# Altium schematic sheet OPA_T12.SchDoc
size 165 x 104 mm; SheetNumber: 1; SheetTotal: 1
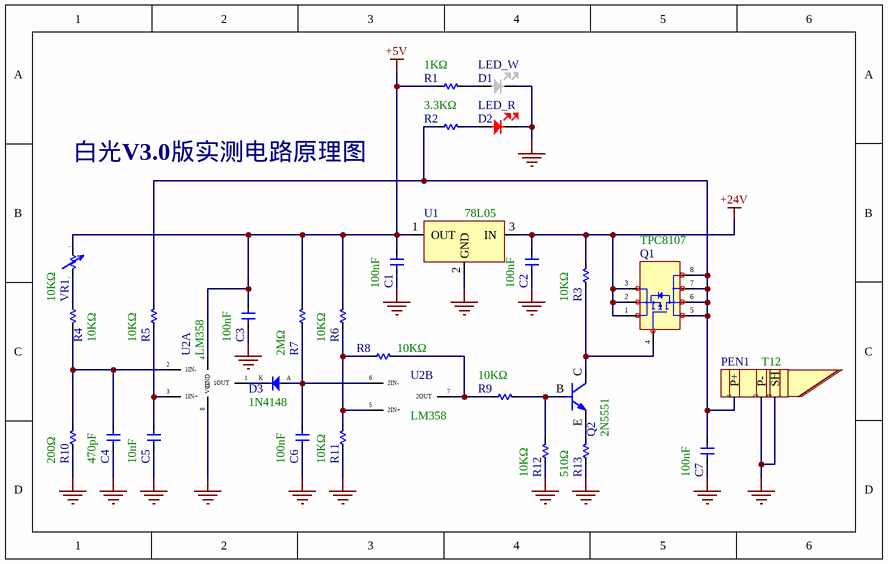
[diagram p0: OPA_T12.SchDoc]

## Parts
C1  100nF
C2  100nF
C3  100nF
C4  470pF
C5  10nF
C6  100nF
C7  100nF
D1  LED_W
D2  LED_R
D3  1N4148
PEN1  T12  [T13]
Q1  TPC8107  [SO-8M]
Q2  2N5551
R1  1KΩ
R2  3.3KΩ
R3  10KΩ
R4  10KΩ
R5  10KΩ
R6  10KΩ
R7  2MΩ
R8  10KΩ
R9  10KΩ
R10  200Ω
R11  10KΩ
R12  10KΩ
R13  510Ω
U1  78L05  [SOT-89]
U2  LM358  [SO-8]  (parts A,B of 2)
VR1  10KΩ

## Nets
+5V: C1.1 C3.1 R1.1 R6.2 R7.2 U1.1(OUT) U2.4(GND) VR1.1
+24V: C2.1 Q1.1(S) Q1.2(S) Q1.3(S) R3.2 U1.3(IN)
GND: C1.2 C2.2 C3.2 C4.2 C5.2 C6.2 C7.2 D1.C(CATHODE) D2.C(CATHODE) PEN1.2(P-) PEN1.3(SH) R10.1 R11.1 R12.1 R13.1 U1.2(GND) U2.8(VCC)
NetC4_1: C4.1 R4.2 R10.2 U2.2(1IN-)
NetC5_1: C5.1 R5.1 U2.3(1IN+)
NetC6_1: C6.1 D3.A(ANODE) R7.1 U2.6(2IN-)
NetC7_1: C7.1 PEN1.1(P+) Q1.5(D) Q1.6(D) Q1.7(D) Q1.8(D) R2.1 R5.2
NetD1_A: D1.A(ANODE) R1.2
NetD2_A: D2.A(ANODE) R2.2
NetD3_K: D3.K(CATHODE) U2.1(1OUT)
NetQ1_4: Q1.4(G) Q2.C(COLLECTOR) R3.1
NetQ2_B: Q2.B(BASE) R9.2 R12.2
NetQ2_E: Q2.E(EMITTER) R13.2
NetR4_1: R4.1 VR1.2
NetR6_1: R6.1 R8.1 R11.2 U2.5(2IN+)
NetR8_2: R8.2 R9.1 U2.7(2OUT)

## Notes on the sheet
- 白光V3.0版实测电路原理图

## Library data of the parts
C1-C7 = CAP NP: 贴片电容
D1 = LED_W: 白色发光二极管
D2 = LED_R: 红色发光二极管
D3 = DIODE
PEN1 = IRON_PEN
Q1 = AO4485: P沟道 40V 10A
Q2 = NPN BCE
R1-R13 = ResSemi: 贴片电阻
U1 = 78L05: 5V线性稳压芯片
U2 = LM393
VR1 = ResSemi_5